# Altium schematic sheet EEPROM.SchDoc: =project_title
size Tabloid; PageSetup: Record=PageOptions|CenterHorizontal=True|CenterVertical=True|PrintScale=0.73|XCorrection=1.00|YCorrection=1.00|PrintKind=0|BorderSize=5000000|LeftOffset=0|BottomOffset=0|Orientation=2|PaperLength=1000|PaperWidth=1000|Scale=100|PaperSource=7|PrintQuality=-4|MediaType=1|DitherType=10|PaperKind=A4|PrintScaleMode=1; CompanyName: Luxonis Holding; Organization: Luxonis Holding; Address1: 1925 Harmony Park Drive; Address2: Westminster, CO; Address3: 80234; Address4: United States; SheetNumber: 8; SheetTotal: 12
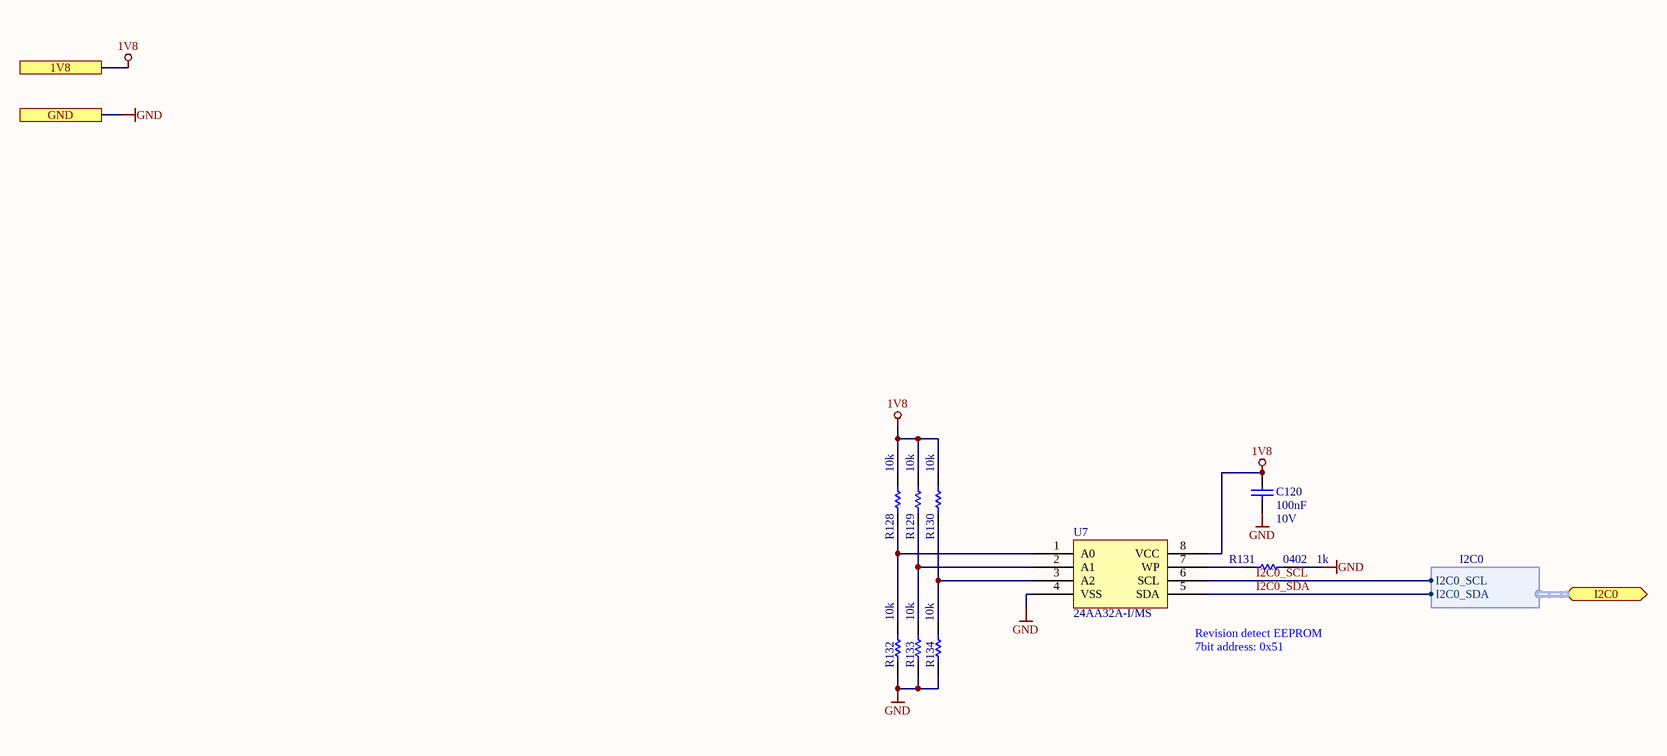
[diagram p0: EEPROM.SchDoc]

## Parts
C120  value 100nF  Voltage Rating: 10V  [CAPC0402(1005)70_L]  (hidden comment: GRM155R71A104JA01D)
R128  value 10k  [RESC0402(1005)_L]  (hidden comment: RC0402FR-1310KL)
R129  value 10k  [RESC0402(1005)_L]  (hidden comment: RC0402FR-1310KL)
R130  value 10k  [RESC0402(1005)_L]  (hidden comment: RC0402FR-1310KL)
R131  value 1k  Case/Package: 0402  [RESC0402(1005)_L]  (hidden comment: RC0402FR-071KL)
R132  value 10k  [RESC0402(1005)_L]  (hidden comment: RC0402FR-1310KL)
R133  value 10k  [RESC0402(1005)_L]  (hidden comment: RC0402FR-1310KL)
R134  value 10k  [RESC0402(1005)_L]  (hidden comment: RC0402FR-1310KL)
U7  24AA32A-I/MS  [24AA32A-I/MS]

## Ports
1V8, GND, I2C0 (bidir, harness I2C0)

## Harnesses
I2C0: I2C0_SCL, I2C0_SDA

## Nets
1V8: C120.2 R128.2 R129.2 R130.2 U7.8(VCC) ; port 1V8
GND: C120.1 R131.1 R132.1 R133.1 R134.1 U7.4(VSS) ; port GND
I2C0_SCL: U7.6(SCL) ; port I2C0.I2C0_SCL
I2C0_SDA: U7.5(SDA) ; port I2C0.I2C0_SDA
NetR128_1: R128.1 R132.2 U7.1(A0)
NetR129_1: R129.1 R133.2 U7.2(A1)
NetR130_1: R130.1 R134.2 U7.3(A2)
NetR131_2: R131.2 U7.7(WP)

## Notes on the sheet
- (near U7) Revision detect EEPROM
- (near U7) 7bit address: 0x51
- Title
- Size:
- Date:
- Tabloid
- Number:
- Time:
- Revision:
- Sheet
- of
- Drawn by:

## Library data of the parts
C120 = CMP-108-000015-5: CAP CER 0.1UF 10V X7R 0402 5%; Manufacturer 1: Murata; Manufacturer Part Number 1: GRM155R71A104JA01D; Case/Package: 0402; Min Operating Temperature: -55°C; Max Operating Temperature: 125°C; Tolerance: 5%; Dielectric: X7R; Length: 1mm; Height: 0.5mm; Width: 0.02inch; Depth: 0.5mm; ComponentLink1URL: https://datasheet.ciiva.com/5411/product-5411135.pdf?src-supplier=Mouser; ComponentLink1Description: https://datasheet.ciiva.com/5411/product-5411135.pdf?src-supplier=Mouser; ComponentLink2URL: https://datasheet.ciiva.com/11618/c02e-11618821.pdf?src-supplier=Avnet; ComponentLink2Description: https://datasheet.ciiva.com/11618/c02e-11618821.pdf?src-supplier=Avnet; Design Item ID: GRM155R71A104JA01D; Mounting Technology: SMT
R128-R130 R132-R134 = CMP-115-000004-8: RES SMD 10K OHM 1% 1/16W 0402; Manufacturer 1: Yageo; Temperature Coefficient: 100ppm/°C; Power Rating: 62.5mW; Voltage Rating: 50V; Manufacturer Part Number 1: RC0402FR-1310KL; Case/Package: 0402; Min Operating Temperature: -55°C; Max Operating Temperature: 155°C; Tolerance: 1%; Design Item ID: RC0402FR-1310KL
R131 = CMP-013-000004-10: RES SMD 1K OHM 1% 1/16W 0402; Manufacturer 1: Yageo; Power Rating: 62.5mW; Voltage Rating: 50V; Min Operating Temperature: -55°C; Max Operating Temperature: 155°C; Manufacturer Part Number 1: RC0402FR-071KL; Tolerance: 1%; Design Item ID: RC0402FR-071KL
U7 = CMP-010-000010-2: IC EEPROM 32K I2C 400KHZ 8MSOP Memory IC 32Kb (4K x 8) I²C 400kHz 900ns 8-MSOP; Manufacturer 1: Microchip; Case/Package: MSOP; Frequency: 400kHz; Memory Size: 32Kb; Manufacturer Part Number 1: 24AA32A-I/MS; Pins: 8